# Altium schematic sheet 05-Core Connector.schdoc
size 307 x 218 mm; Symbol: muban; Device: muban; @Project Name: 12345678; @Create Date: 2025-07-10; @Schematic Name: Mini Oscilloscope; @Page Count: 5; @Update Date: 2025-07-12; @Update Time: 08:22:11; @Page Name: 05-Core Connector; @Page No: 5; @Create Time: 07:28:10; @Board Name: Base Board; Title Block Position: 3; Width: 1170; Height: 825; Region Start: 1; X Region Count: 6; Y Region Count: 4; Blade Width: 10
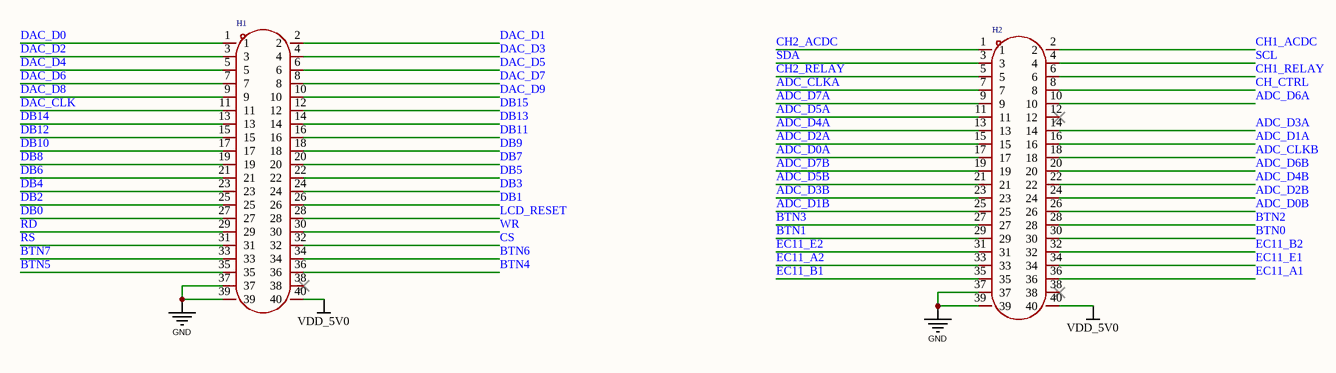
[diagram p0: 05-Core Connector.schdoc]

## Parts
H1  12251220ANG0S115001  [HDR-TH_40P-P2.54-V-M-R2-C20-S2.54]  (value not drawn)
H2  12251220ANG0S115001  [HDR-TH_40P-P2.54-V-M-R2-C20-S2.54]  (value not drawn)

## Nets
GND: H1.37 H1.39 H2.37 H2.39
VDD_5V0: H1.40 H2.40
ADC_CLKA: H2.7
ADC_CLKB: H2.18
ADC_D0A: H2.17
ADC_D0B: H2.26
ADC_D1A: H2.16
ADC_D1B: H2.25
ADC_D2A: H2.15
ADC_D2B: H2.24
ADC_D3A: H2.14
ADC_D3B: H2.23
ADC_D4A: H2.13
ADC_D4B: H2.22
ADC_D5A: H2.11
ADC_D5B: H2.21
ADC_D6A: H2.10
ADC_D6B: H2.20
ADC_D7A: H2.9
ADC_D7B: H2.19
BTN0: H2.30
BTN1: H2.29
BTN2: H2.28
BTN3: H2.27
BTN4: H1.36
BTN5: H1.35
BTN6: H1.34
BTN7: H1.33
CH1_ACDC: H2.2
CH1_RELAY: H2.6
CH2_ACDC: H2.1
CH2_RELAY: H2.5
CH_CTRL: H2.8
CS: H1.32
DAC_CLK: H1.11
DAC_D0: H1.1
DAC_D1: H1.2
DAC_D2: H1.3
DAC_D3: H1.4
DAC_D4: H1.5
DAC_D5: H1.6
DAC_D6: H1.7
DAC_D7: H1.8
DAC_D8: H1.9
DAC_D9: H1.10
DB0: H1.27
DB1: H1.26
DB2: H1.25
DB3: H1.24
DB4: H1.23
DB5: H1.22
DB6: H1.21
DB7: H1.20
DB8: H1.19
DB9: H1.18
DB10: H1.17
DB11: H1.16
DB12: H1.15
DB13: H1.14
DB14: H1.13
DB15: H1.12
EC11_A1: H2.36
EC11_A2: H2.33
EC11_B1: H2.35
EC11_B2: H2.32
EC11_E1: H2.34
EC11_E2: H2.31
LCD_RESET: H1.28
RD: H1.29
RS: H1.31
SCL: H2.4
SDA: H2.3
WR: H1.30

Not connected (* = marked no-connect by the designer): H1 38*; H2 12* 38*

## Notes on the sheet
- 1
- 2
- 3
- 4
- 5
- 6
- A
- B
- C
- D

## Library data of the parts
H1 H2 = 12251220ANG0S115001: Manufacturer: JILN(锦凌); Add into BOM: yes; Pitch: 2.54mm; Pin Structure: 2x20P; Circluar Pins/Square Pins: 方针; Current Rating (Max): 3A; Symbol: 12251220ANG0S115001; Device: 12251220ANG0S115001; Supplier: LCSC; Supplier Part: C429965; Manufacturer Part: 12251220ANG0S115001; JLCPCB Part Class: 扩展库; LCSC Part Name: 2.54mm 2x20P 直插 方针; Supplier Footprint: 插件,P=2.54mm; Datasheet: https://atta.szlcsc.com/upload/public/pdf/source/20190920/C429965_BC46B4ED575BB92CEF1C6420E537C4AD.pdf; Convert to PCB: yes; Number of Rows: 双排; Number of Pins: 40P; Row Spacing: 2.54mm; Mounting Type: 直插; Voltage Rating (Max): -; Length of Mating Pin: 6mm; Insulation Height: 2.5mm; Length of End Connection Pin: 3mm; Contact Material: 黄铜; Contact Plating: -; Operating Temperature Range: -40℃~+105℃; Color: 黑色